# EAGLE design Glove_PCB (EAGLE 9.6.2)
AUTHOR: AGENA, CEJA, TENNEY; BOARD_NAME: GLOVE PCB; DOC_NUM: 1; PROJECT_NAME: GLOVE; REVISION: 0
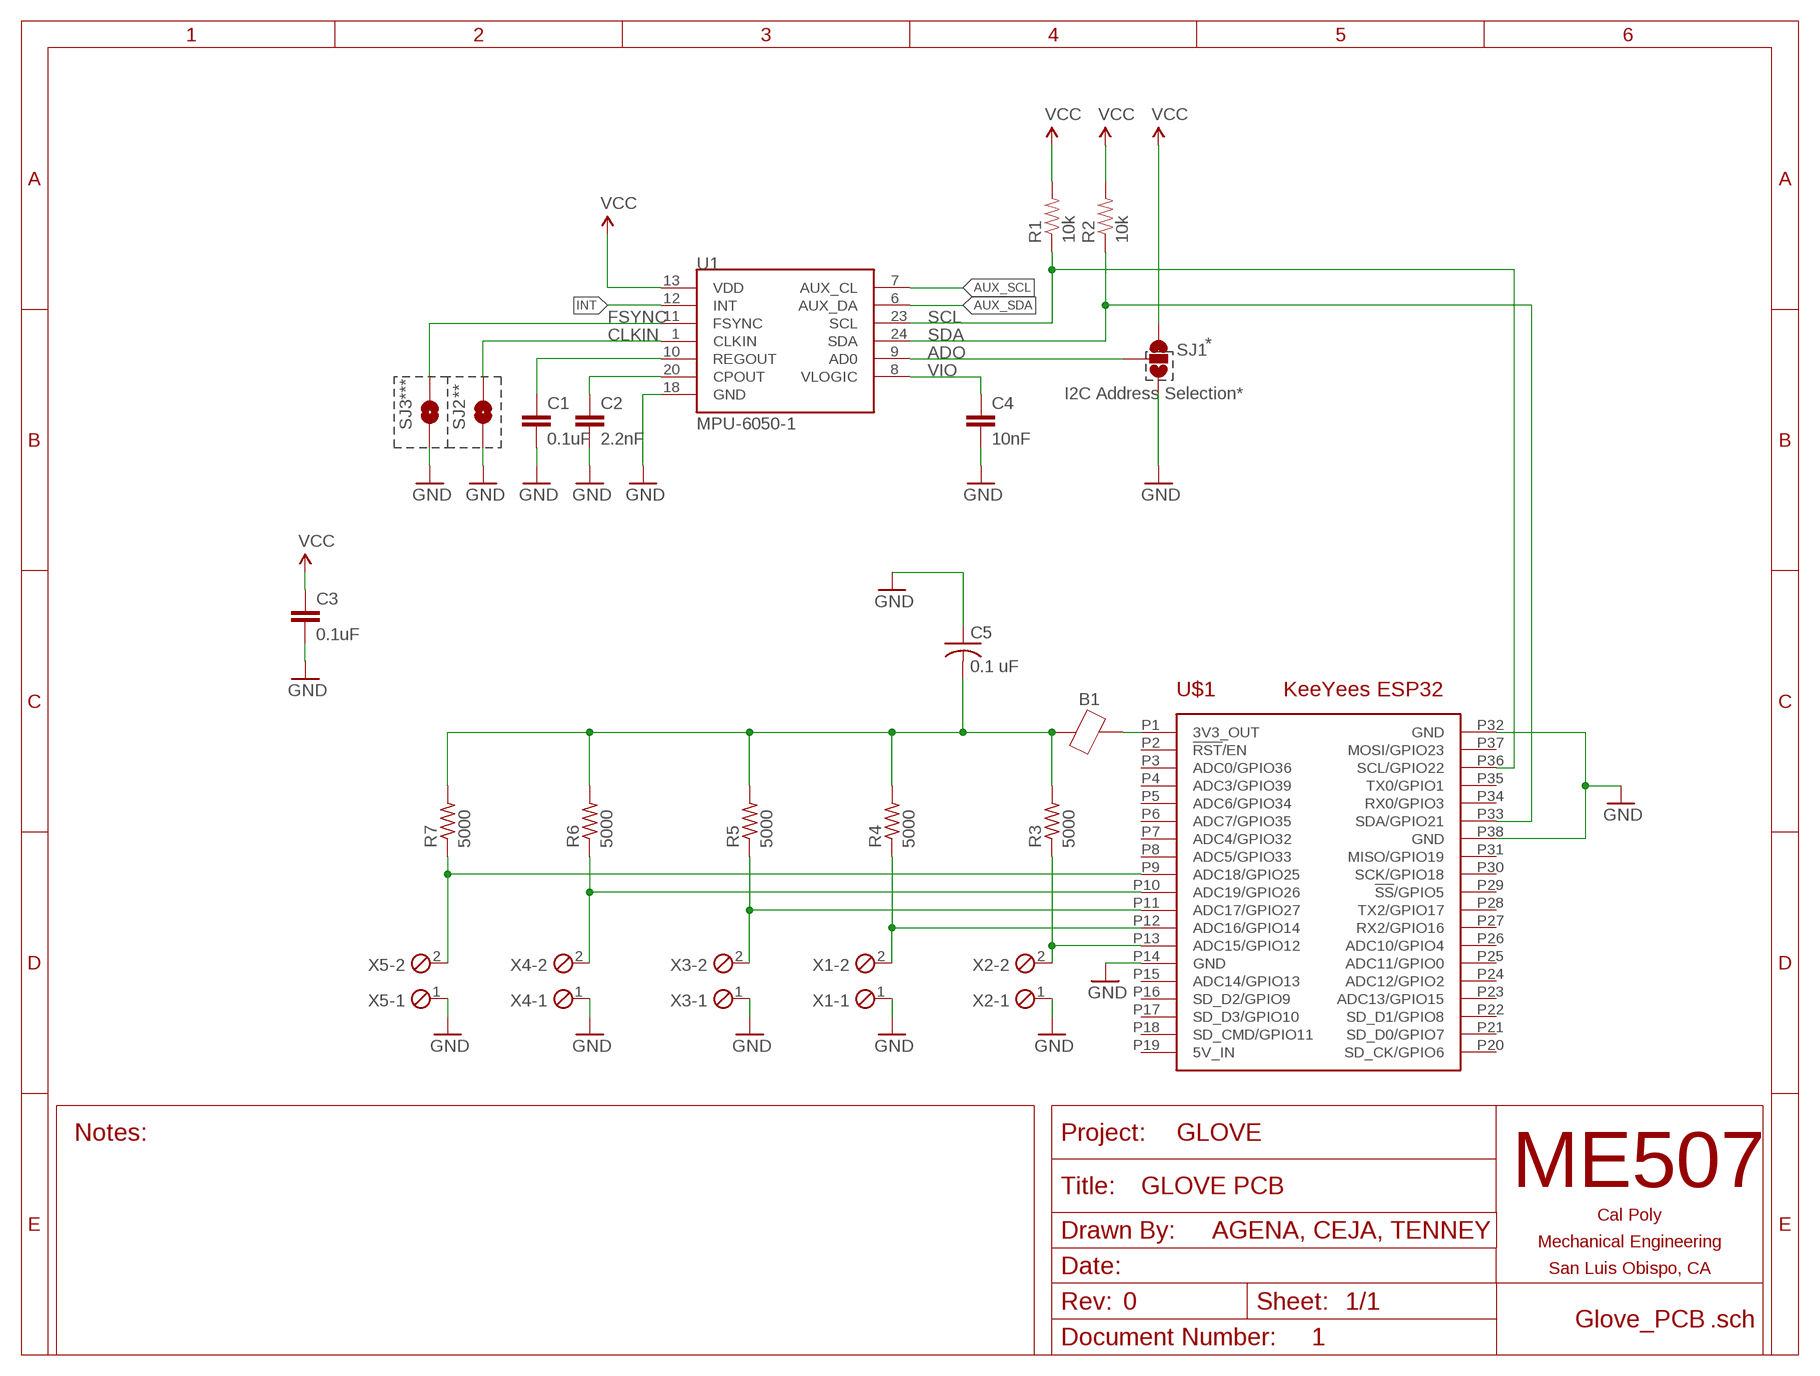
[diagram p0: schematic, sheet 1]

## Parts
B1  BEAD0805  [0805]
C1  0.1uF  CAP0603-CAP  [0603-CAP]
C2  2.2nF  CAP0603-CAP  [0603-CAP]
C3  0.1uF  CAP0603-CAP  [0603-CAP]
C4  10nF  CAP0603-CAP  [0603-CAP]
C5  0.1 uF  C-USC0805  [C0805]
R1  10k  RESISTOR0603-RES  [0603-RES]
R2  10k  RESISTOR0603-RES  [0603-RES]
R3  5000  R-US_R0805  [R0805]
R4  5000  R-US_R0805  [R0805]
R5  5000  R-US_R0805  [R0805]
R6  5000  R-US_R0805  [R0805]
R7  5000  R-US_R0805  [R0805]
SJ1  SOLDERJUMPER_2WAYPASTE2&3  [SJ_3_PASTE2&3]
SJ2  SOLDERJUMPERTRACE  [SJ_2S-TRACE]
SJ3  SOLDERJUMPERTRACE  [SJ_2S-TRACE]
U1  MPU-6050-1  [QFN-24-4MM2]
U$1  KEEYEES_ESP32EXT  [KEEYEES_ESP32_EXTENDED]
X1  SCREWTERM_2P_254  [2POL254]
X2  SCREWTERM_2P_254  [2POL254]
X3  SCREWTERM_2P_254  [2POL254]
X4  SCREWTERM_2P_254  [2POL254]
X5  SCREWTERM_2P_254  [2POL254]

## Nets
ADO: SJ1.2 U1.9(AD0)
AUX_SCL: U1.7(AUX_CL)
AUX_SDA: U1.6(AUX_DA)
CLKIN: SJ2.2 U1.1(CLKIN)
FSYNC: SJ3.2 U1.11(FSYNC)
GND: C1.2 C2.2 C3.2 C4.2 C5.1 SJ1.3 SJ2.1 SJ3.1 U1.18(GND) U$1.P14(GND) U$1.P32(GND) U$1.P38(GND) X1.1 X2.1 X3.1 X4.1 X5.1
INT: U1.12(INT)
N$1: R3.1 U$1.P13(ADC15/GPIO12) X2.2
N$2: R4.1 U$1.P12(ADC16/GPIO14) X1.2
N$3: C2.1 U1.20(CPOUT)
N$4: B1.2 U$1.P1(3V3_OUT)
N$5: C1.1 U1.10(REGOUT)
N$7: R5.1 U$1.P11(ADC17/GPIO27) X3.2
N$9: R6.1 U$1.P10(ADC19/GPIO26) X4.2
N$11: R7.1 U$1.P9(ADC18/GPIO25) X5.2
N$12: B1.1 C5.2 R3.2 R4.2 R5.2 R6.2 R7.2
SCL: R1.1 U1.23(SCL) U$1.P36(SCL/GPIO22)
SDA: R2.1 U1.24(SDA) U$1.P33(SDA/GPIO21)
VCC: C3.1 R1.2 R2.2 SJ1.1 U1.13(VDD)
VIO: C4.1 U1.8(VLOGIC)
Unconnected: U$1.P2(!RST!/EN) U$1.P3(ADC0/GPIO36) U$1.P4(ADC3/GPIO39) U$1.P5(ADC6/GPIO34) U$1.P6(ADC7/GPIO35) U$1.P7(ADC4/GPIO32) U$1.P8(ADC5/GPIO33) U$1.P15(ADC14/GPIO13) U$1.P16(SD_D2/GPIO9) U$1.P17(SD_D3/GPIO10) U$1.P18(SD_CMD/GPIO11) U$1.P20(SD_CK/GPIO6) U$1.P21(SD_D0/GPIO7) U$1.P22(SD_D1/GPIO8) U$1.P23(ADC13/GPIO15) U$1.P24(ADC12/GPIO2) U$1.P25(ADC11/GPIO0) U$1.P26(ADC10/GPIO4) U$1.P27(RX2/GPIO16) U$1.P28(TX2/GPIO17) U$1.P29(!SS!/GPIO5) U$1.P30(SCK/GPIO18) U$1.P31(MISO/GPIO19) U$1.P34(RX0/GPIO3) U$1.P35(TX0/GPIO1) U$1.P37(MOSI/GPIO23)

## Notes on the sheet
- *
- *** | ** | I2C Address Selection*

## Power pins joined to a net without a drawn wire
5V_IN: U$1.P19(5V_IN)

## Library data of the parts
B1 = ME507:BEAD: Ferrite Bead
C1-C4 = SparkFun:CAP: Capacitor Standard 0603 ceramic capacitor, and 0.1" leaded capacitor.
C5 = rcl:C-US: CAPACITOR, American symbol; SPICEPREFIX: C
R1 R2 = SparkFun:RESISTOR: Resistor Basic schematic elements and footprints for 0603, 1206, and PTH resistors.
R3-R7 = rcl:R-US_: RESISTOR, American symbol; SPICEPREFIX: R
SJ1 = SparkFun:SOLDERJUMPER_2WAY: Solder Jumper 2 way solder jumper
SJ2 SJ3 = SparkFun:SOLDERJUMPER: Solder Jumper Standard SMD solder jumper. Used to automate production. Two varients : Normally Open and Normally Closed are the same, but have different paste layers. NC will have a large amount of paste and should jumper during reflow.
U1 = Testing:MPU-6050
U$1 = ME507:KEEYEES_ESP32: Footprint for an add-on board (shield, hat, etc.) for a KeeYees ESP32 development board with ESP-WROOM-32 module. 38 pins.
X1-X5 = ME507:SCREWTERM_2P: Screw Terminal Block This part is designed for a screw terminal connector. The 2.54mm (0.100 inch) foorprint can also be used for male or female pin headers such as those on most development boards. One can also solder wires directly into the holes, though this makes modifications or repairs to the system more inconvenient. Larger versions can carry more current.

## Board
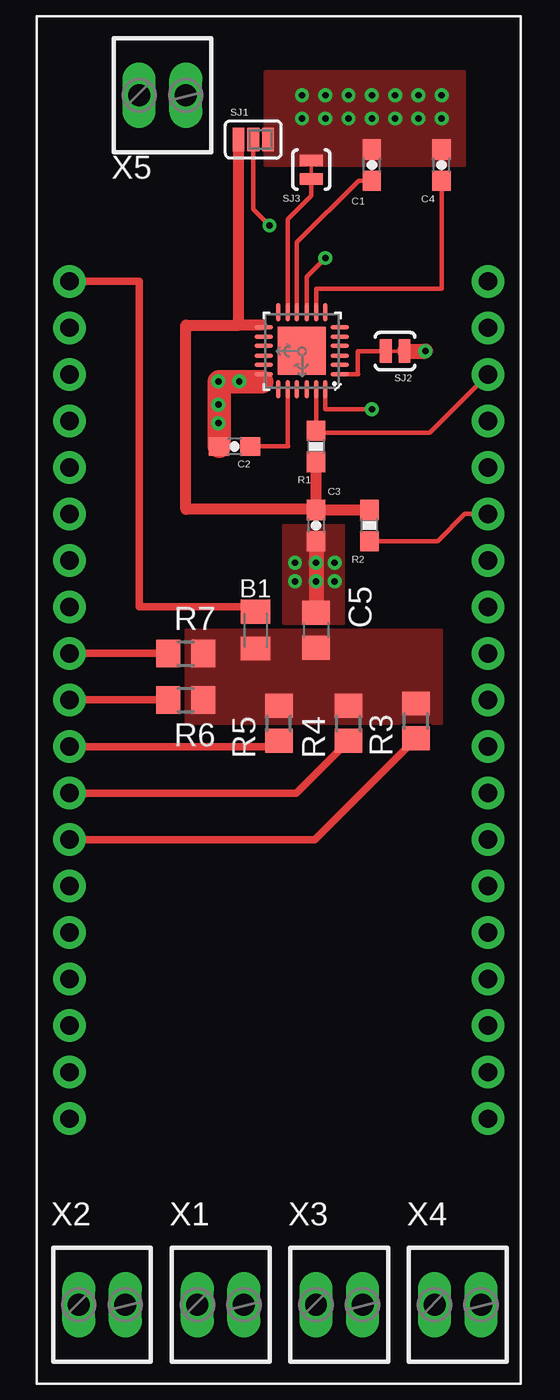
[diagram p1: board, top side]
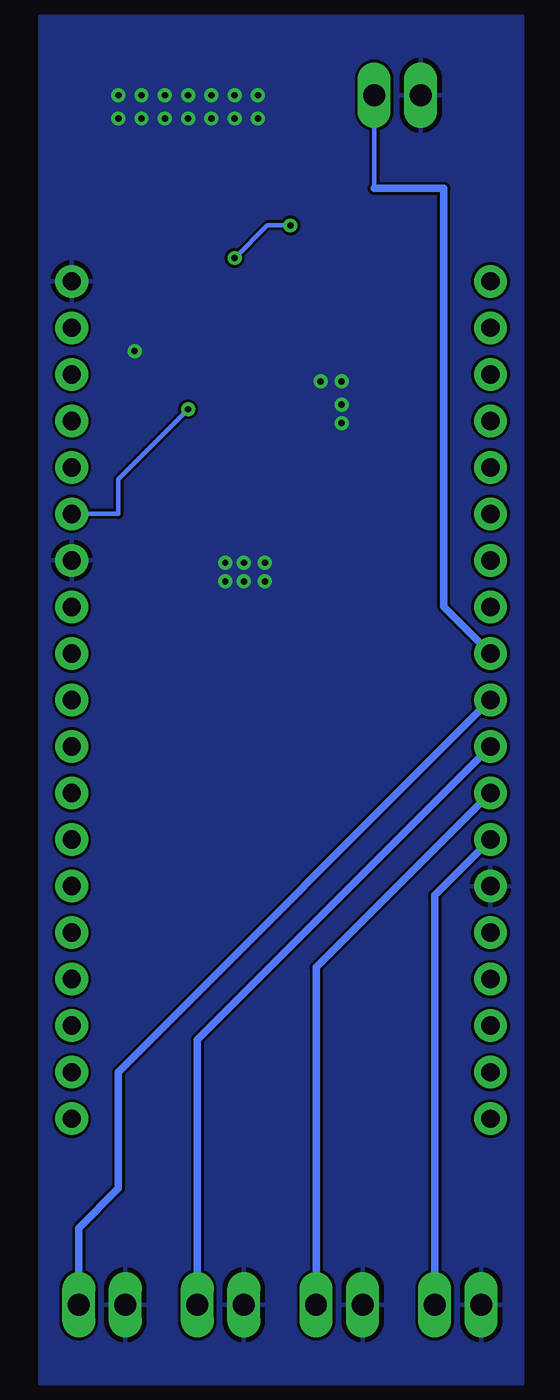
[diagram p2: board, bottom side, seen from below]

No outline drawn. Coordinates in mm, seen from the top.
Copper layers (1*16): Top 0.035mm / dielectric 1.5mm / Bottom 0.035mm
Design rules "default": minimum track width 6mil, minimum drill 0.35mm, track to track 6mil, track to pad 6mil, pad to pad 6mil, via to via 6mil, smd to smd 6mil, copper to edge 40mil, drill to drill 6mil, minimum pad ring 10mil, minimum via ring 8mil, stop-mask expansion 4mil, vias tented up to drill 0mil, thermal gap 10mil

### Footprints (pad centres in the part's own frame; a part is rotated, then mirrored left to right if it is on the bottom)
0805 = smd 1.3 x 1.6: 1 -1,0; 2 1,0
0603-CAP = smd 1.1 x 1: 1 -0.85,0; 2 0.85,0
C0805 = smd 1.3 x 1.5: 1 -0.95,0; 2 0.95,0
0603-RES = smd 1.1 x 1: 1 -0.85,0; 2 0.85,0
R0805 = smd 1.3 x 1.5: 1 -0.95,0; 2 0.95,0
SJ_3_PASTE2&3 = smd 0.635 x 1.27: 1 -0.813,0; 2 0,0; 3 0.813,0
SJ_2S-TRACE = smd 0.635 x 1.27: 1 -0.508,0; 2 0.508,0
QFN-24-4MM2 = smd 1.016 x 0.254: 1 -2.066,1.257; 2 -2.066,0.75; 3 -2.066,0.247; 4 -2.066,-0.287; 5 -2.066,-0.792; 6 -2.066,-1.297; 13 2.086,-1.297; 14 2.086,-0.792; 15 2.086,-0.287; 16 2.086,0.247; 17 2.086,0.75; 18 2.086,1.257 | smd 0.254 x 1.016: 7 -1.267,-2.122; 8 -0.762,-2.122; 9 -0.258,-2.122; 10 0.278,-2.122; 11 0.78,-2.122; 12 1.287,-2.122; 19 1.287,2.082; 20 0.78,2.082; 21 0.278,2.082; 22 -0.258,2.082; 23 -0.762,2.082; 24 -1.267,2.082 | smd 2.616 x 2.616: P$1 0.02,-0.01
KEEYEES_ESP32_EXTENDED = drill 1 pad 1.778: P1 -11.43,21.59; P2 -11.43,19.05; P3 -11.43,16.51; P4 -11.43,13.97; P5 -11.43,11.43; P6 -11.43,8.89; P7 -11.43,6.35; P8 -11.43,3.81; P9 -11.43,1.27; P10 -11.43,-1.27; P11 -11.43,-3.81; P12 -11.43,-6.35; P13 -11.43,-8.89; P14 -11.43,-11.43; P15 -11.43,-13.97; P16 -11.43,-16.51; P17 -11.43,-19.05; P18 -11.43,-21.59; P19 -11.43,-24.13; P20 11.43,-24.13; P21 11.43,-21.59; P22 11.43,-19.05; P23 11.43,-16.51; P24 11.43,-13.97; P25 11.43,-11.43; P26 11.43,-8.89; P27 11.43,-6.35; P28 11.43,-3.81; P29 11.43,-1.27; P30 11.43,1.27; P31 11.43,3.81; P32 11.43,6.35; P33 11.43,8.89; P34 11.43,11.43; P35 11.43,13.97; P36 11.43,16.51; P37 11.43,19.05; P38 11.43,21.59
2POL254 = drill 1.2 long: 1 -1.27,0; 2 1.27,0

### Placement (x,y rotation side)
B1  -1.27,2.54 90 top
C1  5.08,27.94 90 top
C2  -2.41,12.57 180 top
C3  2.03,8.26 270 top
C4  8.89,27.94 90 top
C5  2.03,2.54 270 top
R1  2.03,12.57 270 top
R2  4.95,8.26 90 top
R3  7.49,-2.41 90 top
R4  3.81,-2.54 90 top
R5  0,-2.54 90 top
R6  -5.08,-1.27 0 top
R7  -5.08,1.27 0 top
SJ1  -1.4,29.34 0 top
SJ2  6.35,17.78 180 top
SJ3  1.78,27.69 270 top
U1  1.27,17.78 180 top
U$1  0,0 0 top
X1  -3.17,-34.29 0 top
X2  -9.65,-34.29 0 top
X3  3.3,-34.29 0 top
X4  9.78,-34.29 0 top
X5  -6.35,31.75 0 top

### Tracks (layer width: path | path; a pad name or v marks a point on that pad's centre or on a via)
ADO  (via drill 0.35)
  Top 0.254: SJ1.2 -1.4,25.53 v-0.51,24.64 | U1.9 1.53,21.85 v2.54,22.86
  Bottom 0.254: v-0.51,24.64 0.76,24.64 v2.54,22.86
CLKIN
  Top 0.254: U1.1 4.33,16.52 4.32,16.54 4.32,17.78 SJ2.2
FSYNC
  Top 0.254: U1.11 0.49,24.98 1.78,26.27 SJ3.2
GND  (via drill 0.35)
  Top 0.406: v-2.16,16.13 -1.21,16.13 U1.18 -0.82,16.23 -0.93,16.12
  Top 0.813: C5.1 v2.03,5.21 v2.03,6.22 C3.2 | SJ2.1 v8,17.78
  Top 1.27: C2.2 -3.26,16.12 -0.93,16.12
  other vias: -3.3,16.13 -3.3,13.84 -3.3,14.86 1.27,31.75 2.54,31.75 3.81,31.75 5.08,31.75 6.35,31.75 7.62,31.75 8.89,31.75 1.27,30.48 2.54,30.48 3.81,30.48 5.08,30.48 6.35,30.48 7.62,30.48 8.89,30.48 3.05,5.21 3.05,6.22 0.89,5.21 0.89,6.22
  pour Bottom: -13.21,36.07 13.21,36.07 13.21,-38.61 -13.21,-38.61
  pour Top (no thermals): -0.76,27.94 10.16,27.94 10.16,33.02 -0.76,33.02
  pour Top (no thermals): 3.43,8.26 0.25,8.26 0.25,2.92 3.56,2.92 3.56,8.26
N$1
  Top 0.406: U$1.P13 1.97,-8.89 R3.1
  Bottom 0.406: U$1.P13 -8.38,-11.94 X2.2
N$2
  Top 0.406: U$1.P12 0.95,-6.35 R4.1
  Bottom 0.406: U$1.P12 -1.91,-15.88 X1.2
N$3
  Top 0.254: U1.20 0.49,12.59 0.51,12.57 C2.1
N$4
  Top 0.254: B1.2 -1.54,3.81
  Top 0.406: U$1.P1 -7.62,21.59 -7.62,4.83 -7.62,3.81 -1.54,3.81
N$5
  Top 0.254: U1.10 0.99,23.73 4.36,27.09 C1.1
N$7
  Top 0.406: U$1.P11 -0.32,-3.81 R5.1
  Bottom 0.406: U$1.P11 4.57,-19.81 X3.2
N$9
  Top 0.406: U$1.P10 R6.1
  Bottom 0.406: U$1.P10 8.89,-21.59 8.89,-27.94 11.05,-30.1 X4.2
N$11
  Top 0.406: U$1.P9 R7.1
  Bottom 0.254: X5.2 -5.08,26.67
  Bottom 0.406: U$1.P9 -8.89,3.81 -8.89,26.67 -5.08,26.67
N$12
  Top 0.406: -0.32,-1.27 R5.2 | 7.37,-1.59 R3.2
  pour Top (no thermals): -5.08,2.54 -5.08,-2.54 8.89,-2.54 8.89,2.54
SCL
  Top 0.254: U$1.P36 8.26,13.34 2.12,13.34 R1.1 U1.23 | U1.23
SDA  (via drill 0.35)
  Top 0.254: U1.24 2.54,14.61 v5.08,14.61 | R2.1 8.68,7.41 10.16,8.89 U$1.P33
  Bottom 0.254: v5.08,14.61 8.89,10.79 8.89,8.89 U$1.P33
VCC
  Top 0.254: U1.13 -0.94,19.2
  Top 0.61: C3.1 1.99,9.14 -5.08,9.14 -5.08,19.2 -2.16,19.2 | C3.1 R1.2 | C3.1 R2.2 | -0.94,19.2 -2.16,19.2 | -2.16,19.2 -2.21,19.25 SJ1.1
VIO
  Top 0.254: C4.1 8.89,21.17 2.03,21.17 U1.8